# EAGLE design DCDC-Relay (EAGLE 9.5.2)
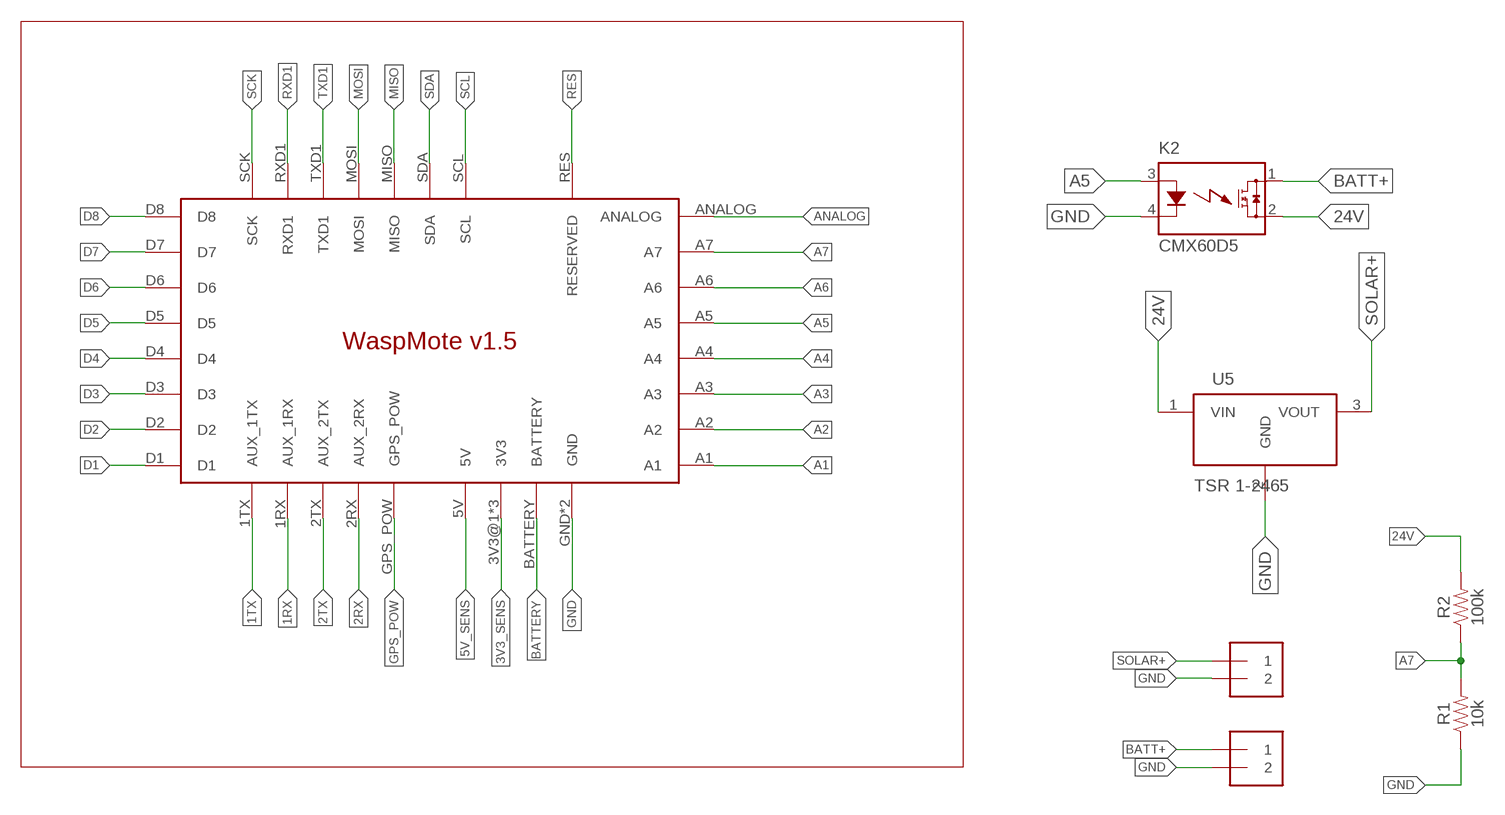
[diagram p0: schematic, sheet 1]

## Parts
J1  1X2-3.5MM  [1X2-3.5MM]
J2  1X2-3.5MM  [1X2-3.5MM]
K2  CMX60D5  [CMX60D5]
R1  10k  10KOHM-HORIZ-1/4W-5%  [AXIAL-0.3]
R2  100k  100KOHM-HORIZ-1/4W-1%  [AXIAL-0.3]
U5  TSR 1-2465  173010535  [173010535]
U$1  WASPMOTE_V1.5  [WASPMOTE_V1.5]

## Nets
1RX: U$1.1RX(AUX_1RX)
1TX: U$1.1TX(AUX_1TX)
2RX: U$1.2RX(AUX_2RX)
2TX: U$1.2TX(AUX_2TX)
3V3_SENS: U$1.3V3@1(3V3) U$1.3V3@2(3V3) U$1.3V3@3(3V3)
5V_SENS: U$1.5V
24V: K2.2(DS2) R2.P$2 U5.1(VIN)
A1: U$1.A1
A2: U$1.A2
A3: U$1.A3
A4: U$1.A4
A5: K2.3(A) U$1.A5
A6: U$1.A6
A7: R1.P$2 R2.P$1 U$1.A7
ANALOG: U$1.ANALOG
BATT+: J1.1 K2.1(DS1)
BATTERY: U$1.BATTERY
D1: U$1.D1
D2: U$1.D2
D3: U$1.D3
D4: U$1.D4
D5: U$1.D5
D6: U$1.D6
D7: U$1.D7
D8: U$1.D8
GND: J1.2 J2.2 K2.4(K) R1.P$1 U5.2(GND) U$1.GND U$1.GND_2(GND)
GPS_POW: U$1.GPS_POW
MISO: U$1.MISO
MOSI: U$1.MOSI
RES: U$1.RES(RESERVED)
RXD1: U$1.RXD1
SCK: U$1.SCK
SCL: U$1.SCL
SDA: U$1.SDA
SOLAR+: J2.1 U5.3(VOUT)
TXD1: U$1.TXD1

## Library data of the parts
J1 J2 = adafruit:1X2: 3.5mm Terminal block http://www.ladyada.net/library/pcb/eaglelibrary.html
K2 = DCDC-Relay:CMX60D5: http://www.crydom.com/en/products/catalog/cmx-series-dc-pcb-mount.pdf
R1 = SparkFun-Resistors:10KOHM: 10kΩ resistor A resistor is a passive two-terminal electrical component that implements electrical resistance as a circuit element. Resistors act to reduce current flow, and, at the same time, act to lower voltage levels within circuits. - Wikipedia; PROD_ID: RES-09435
R2 = SparkFun-Resistors:100KOHM: 100kΩ resistor A resistor is a passive two-terminal electrical component that implements electrical resistance as a circuit element. Resistors act to reduce current flow, and, at the same time, act to lower voltage levels within circuits. - Wikipedia; PROD_ID: RES-12184
U5 = DC-DC Converter:173010535: FDSM FIXED STEP DOWN REGULATOR M Manufacturer's datasheet <https://www.we-online.com/catalog/datasheet/173010335.pdf>; CREATED_BY: PCBLayout.com; DIGIKEY_PARTNO: 732-173010535-ND; MANUFACTURER: Würth Elektronik; MPN: 173010535
U$1 = UIO-John:WASPMOTE_V1.5: WaspMote v1.5 (c) 2017 john.hulth@geo.uio.no

## Board
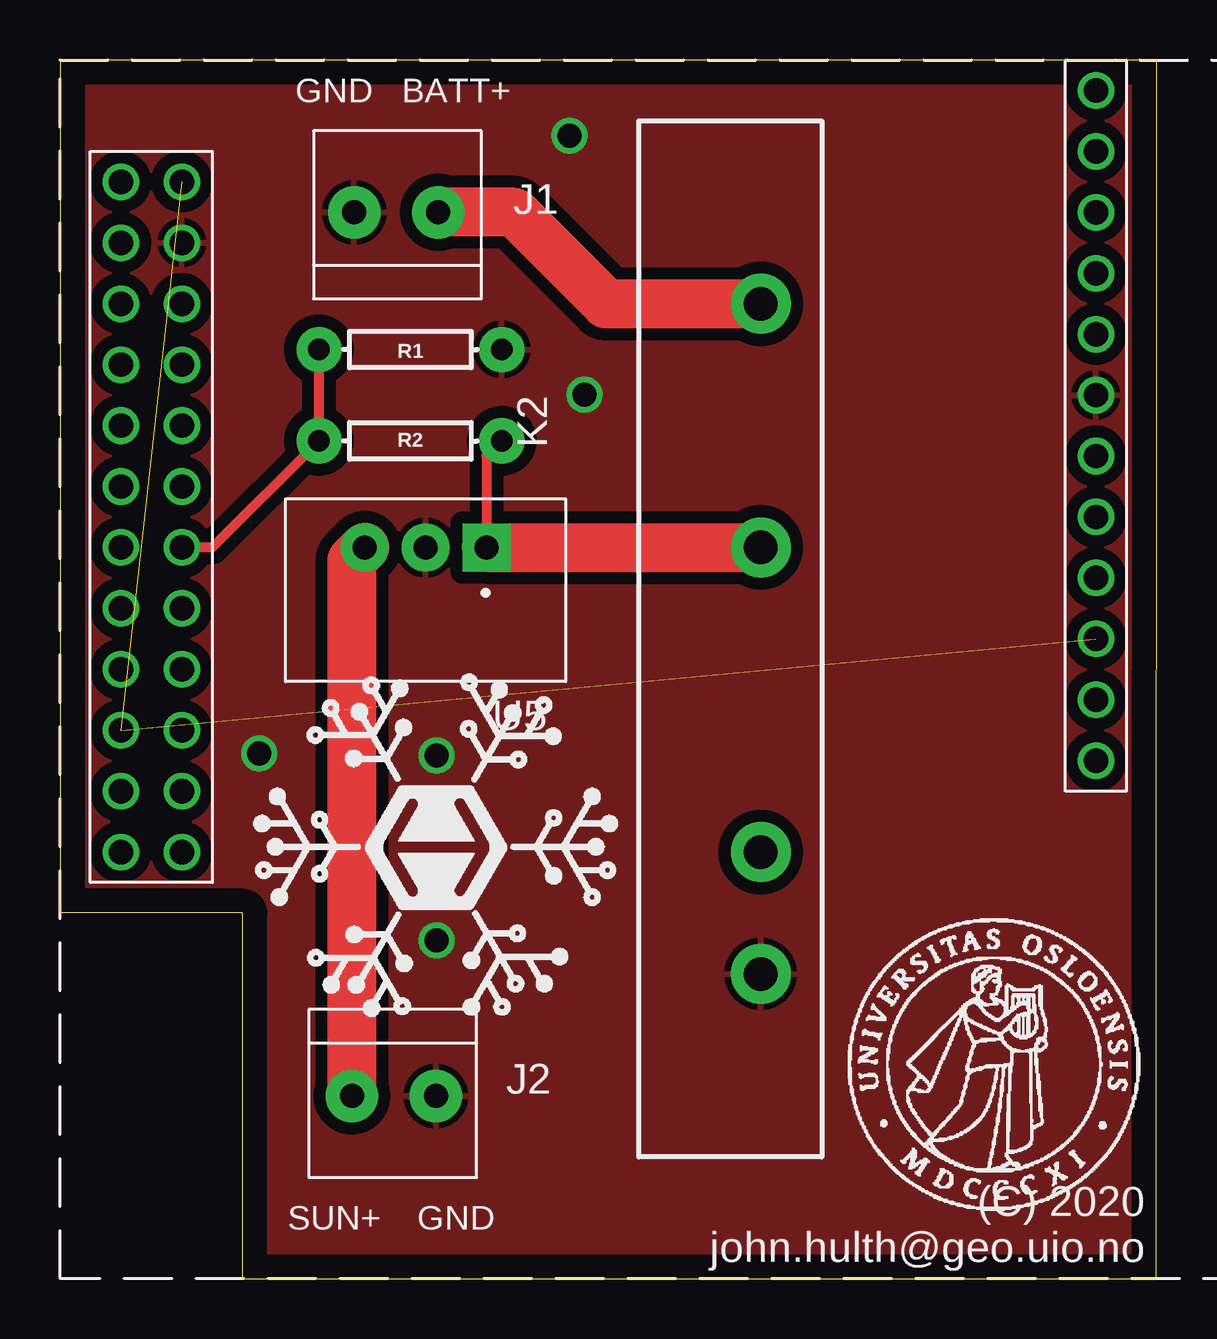
[diagram p1: board, top side]
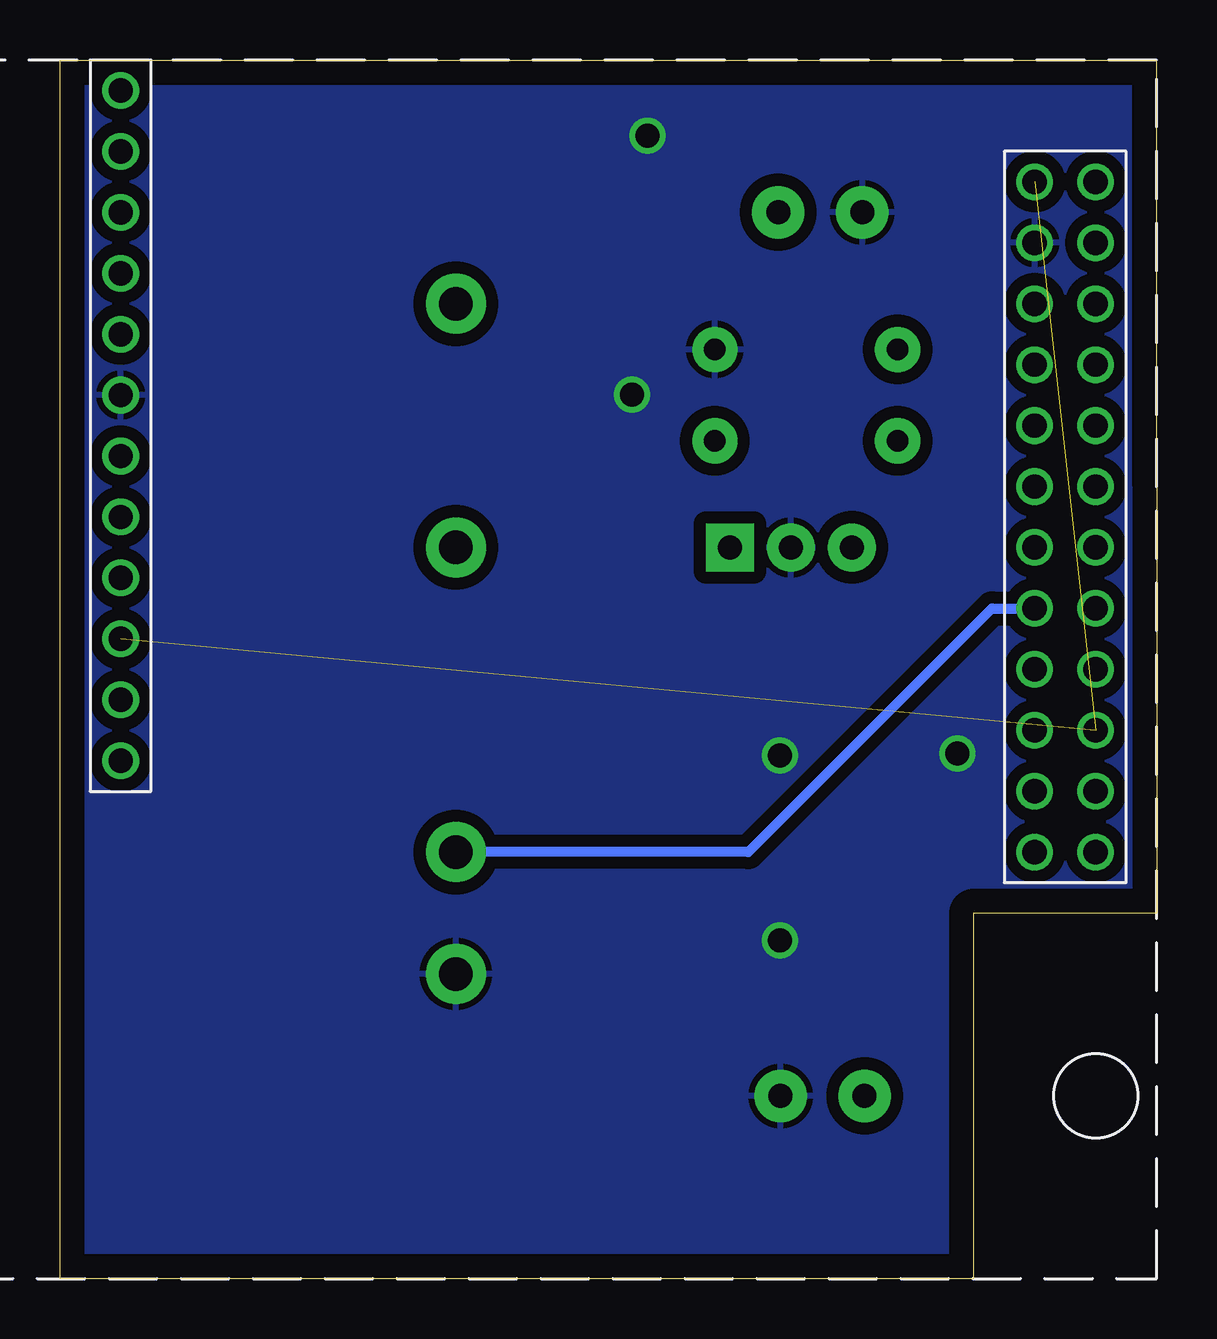
[diagram p2: board, bottom side, seen from below]

Size 45.71 x 50.8 mm. Coordinates in mm from the lower left corner, seen from the top.
Outline: 7.62,0 45.7,0 45.71,50.8 0.01,50.8 0,15.24 7.62,15.24 7.62,0
Copper layers (1*16): Top 0.035mm / dielectric 1.5mm / Bottom 0.035mm
Design rules "default *": minimum track width 6mil, minimum drill 0.35mm, track to track 20mil, track to pad 6mil, pad to pad 6mil, via to via 6mil, smd to smd 6mil, copper to edge 40mil, drill to drill 6mil, minimum pad ring 10mil, minimum via ring 8mil, stop-mask expansion 4mil, vias tented up to drill 0mil, thermal gap 10mil

### Footprints (pad centres in the part's own frame; a part is rotated, then mirrored left to right if it is on the bottom)
1X2-3.5MM = drill 1 pad 2.184: 1 1.8,0; 2 -1.7,0
CMX60D5 = drill 1.4 pad 2.5: 1 35.56,2.54; 2 25.4,2.54; 3 12.7,2.54; 4 7.62,2.54
AXIAL-0.3 = drill 0.9 pad 1.88: P$1 -3.81,0; P$2 3.81,0
173010535 = drill 1 pad 2 square: 1 -2.54,0 | drill 1 pad 2: 2 0,0; 3 2.54,0
WASPMOTE_V1.5 = drill 1.016: 1RX 43.18,46.99; 1TX 43.18,49.53; 2RX 43.18,44.45; 2TX 43.18,41.91; 3V3@1 5.08,45.72; 3V3@2 2.54,22.86; 3V3@3 43.18,26.67; 5V 5.08,20.32; A1 5.08,22.86; A2 2.54,25.4; A3 5.08,25.4; A4 2.54,27.94; A5 5.08,27.94; A6 2.54,30.48; A7 5.08,30.48; ANALOG 2.54,45.72; BATTERY 43.18,39.37; D1 5.08,33.02; D2 2.54,35.56; D3 5.08,35.56; D4 2.54,38.1; D5 5.08,38.1; D6 2.54,40.64; D7 5.08,40.64; D8 2.54,43.18; GND 5.08,43.18; GND_2 43.18,36.83; GPS_POW 2.54,20.32; MISO 43.18,21.59; MOSI 43.18,24.13; RES 2.54,33.02; RXD1 43.18,31.75; SCK 43.18,34.29; SCL 5.08,17.78; SDA 2.54,17.78; TXD1 43.18,29.21

### Placement (x,y rotation side)
J1  13.97,44.45 0 top
J2  13.97,7.62 180 top
K2  31.75,5.08 90 top
R1  14.61,38.73 180 top
R2  14.61,34.92 0 top
U5  15.24,30.48 180 top
U$1  0,0 0 top
U$2  [HIVE-LOGO]  15.7,18 0 top
U$3  [UIO-LOGO-BL]  32.6,2.6 0 top

### Tracks (layer width: path | path; a pad name or v marks a point on that pad's centre or on a via)
3V3_SENS  (2 unrouted)
24V
  Top 0.406: R2.P$2 17.78,34.29 U5.1
  Top 2.032: U5.1 K2.2
A5
  Bottom 0.406: U$1.A5 6.86,27.94 17.02,17.78 K2.3
A7
  Top 0.406: R1.P$2 R2.P$1 6.35,30.48 U$1.A7
BATT+
  Top 2.032: J1.1 18.95,44.45 22.75,40.64 K2.1
GND  (via drill 1)
  other vias: 15.7,21.8 15.7,14.1 8.3,21.9 21.23,47.64 21.86,36.84
  pour Top: 0,0 0,53.34 45.72,53.34 45.72,0
  pour Bottom: 0,52.07 45.72,52.07 45.72,0 0,0
SOLAR+
  Top 2.032: J2.1 12.17,29.95 U5.3

### Text on the board
tPlace: GND | BATT+ | (C) 2020 / john.hulth@geo.uio.no | SUN+ | GND